# Altium project LCR.PrjPcb
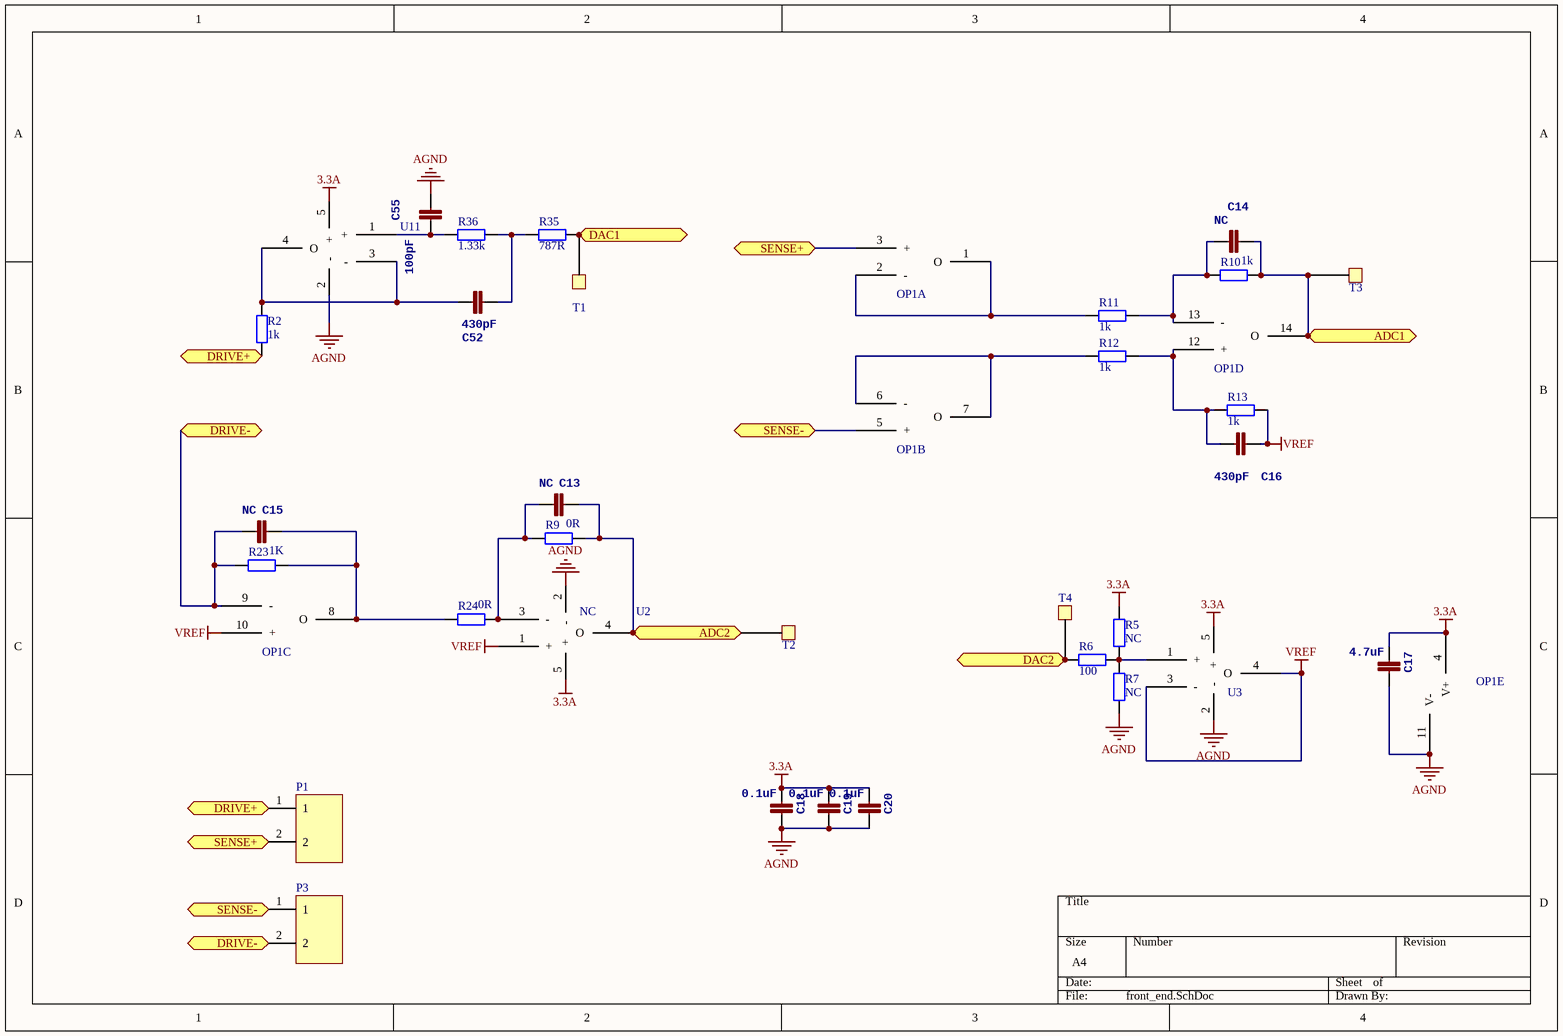
[diagram p0: front_end.SchDoc]
3 sheets, 74 parts. Net scope: flat (ports and power ports of the same name join across sheets).
Board file: LCR.PcbDoc
Sheets:
  front_end.SchDoc
  mcu.SchDoc
  power.SchDoc

## Sheet front_end.SchDoc
size A4

### Parts
C13  NC  [0402]
C14  NC  [0402]
C15  NC  [0402]
C16  430pF  [0402]
C17  4.7uF  [0603]
C18  0.1uF  [0402]
C19  0.1uF  [0402]
C20  0.1uF  [0402]
C52  430pF  [0402]
C55  100pF  [0402]
OP1  MCP6024  [TSSOP14_44MM_065P]  (value not drawn)  (parts A,B,C,D,E of 5)
P1  (no value)  [5.08-2P]
P3  (no value)  [5.08-2P]
R2  1k  [0603]
R5  NC  [0402]
R6  100  [0402]
R7  NC  [0402]
R9  0R  [0402]
R10  1k  [0402]
R11  1k  [0402]
R12  1k  [0402]
R13  1k  [0402]
R23  1K  [0603]
R24  0R  [0402]
R35  787R  [0402]
R36  1.33k  [0402]
T1  (no value)  [TestPad]
T2  (no value)  [TestPad]
T3  (no value)  [TestPad]
T4  (no value)  [TestPad]
U2  NC  [SOT23-5]
U3  OP-SOT23  [SOT23-5]  (value not drawn)
U11  OP-SOT23  [SOT23-5]  (value not drawn)

### Ports
ADC1, ADC2, DAC1, DAC2, DRIVE+, DRIVE-, SENSE+, SENSE-

### Nets
3.3A: C17.2 C18.2 C19.2 C20.2 OP1.4(V+) R5.2 U2.5(+) U3.5(+) U11.5(+)
AGND: C17.1 C18.1 C19.1 C20.1 C55.1 OP1.11(V-) R7.2 U2.2(-) U3.2(-) U11.2(-)
VREF: C16.1 OP1.10(+) R13.1 U2.1(+) U3.3(-) U3.4(O)
NetC13_1: C13.1 R9.1 T2.1 U2.4(O) ; port ADC2
NetC13_2: C13.2 R9.2 R24.1 U2.3(-)
NetC14_1: C14.1 OP1.14(O) R10.1 T3.1 ; port ADC1
NetC14_2: C14.2 OP1.13(-) R10.2 R11.1
NetC15_1: C15.1 OP1.8(O) R23.1 R24.2
NetC15_2: C15.2 OP1.9(-) P3.2 R23.2 ; port DRIVE-
NetC16_2: C16.2 OP1.12(+) R12.1 R13.2
NetC52_1: C52.1 R2.1 U11.3(-) U11.4(O)
NetC52_2: C52.2 R35.1 R36.2
NetC55_2: C55.2 R36.1 U11.1(+)
NetMCU1_20: R35.2 T1.1 ; port DAC1
NetMCU1_21: R6.2 T4.1 ; port DAC2
NetOP1_1: OP1.1(O) OP1.2(-) R11.2
NetOP1_3: OP1.3(+) P1.2 ; port SENSE+
NetOP1_5: OP1.5(+) P3.1 ; port SENSE-
NetOP1_6: OP1.6(-) OP1.7(O) R12.2
NetP1_1: P1.1 R2.2 ; port DRIVE+
NetR5_1: R5.1 R6.1 R7.1 U3.1(+)

### Library data of the parts
C13-C20 C52 C55 = CAP0402-CAP: <b>Capacitor</b> / Standard 0603 ceramic capacitor, and 0.1" leaded capacitor.; PARTNO: CC0402ZRY5V7BB104
OP1 = OP-SOP14
P1 P3 = 2P
R2 R5-R7 R9-R13 R23 R24 = Res2: Resistor; Value: 0Ohm; Published: 8-Jun-2000; LatestRevisionDate: 17-Jul-2002; LatestRevisionNote: Re-released for DXP Platform.; PackageReference: AXIAL-0.4; Publisher: Altium Limited; PackageDescription: Axial Device, Thru-Hole; 2 Leads; 0.4 in Pin Spacing
R35 R36 = Res2: Resistor; Published: 8-Jun-2000; LatestRevisionDate: 17-Jul-2002; LatestRevisionNote: Re-released for DXP Platform.; PackageReference: AXIAL-0.4; Publisher: Altium Limited; PackageDescription: Axial Device, Thru-Hole; 2 Leads; 0.4 in Pin Spacing
T1-T4 = TestPad
U2 = OP-SOT23

## Sheet mcu.SchDoc
size A4
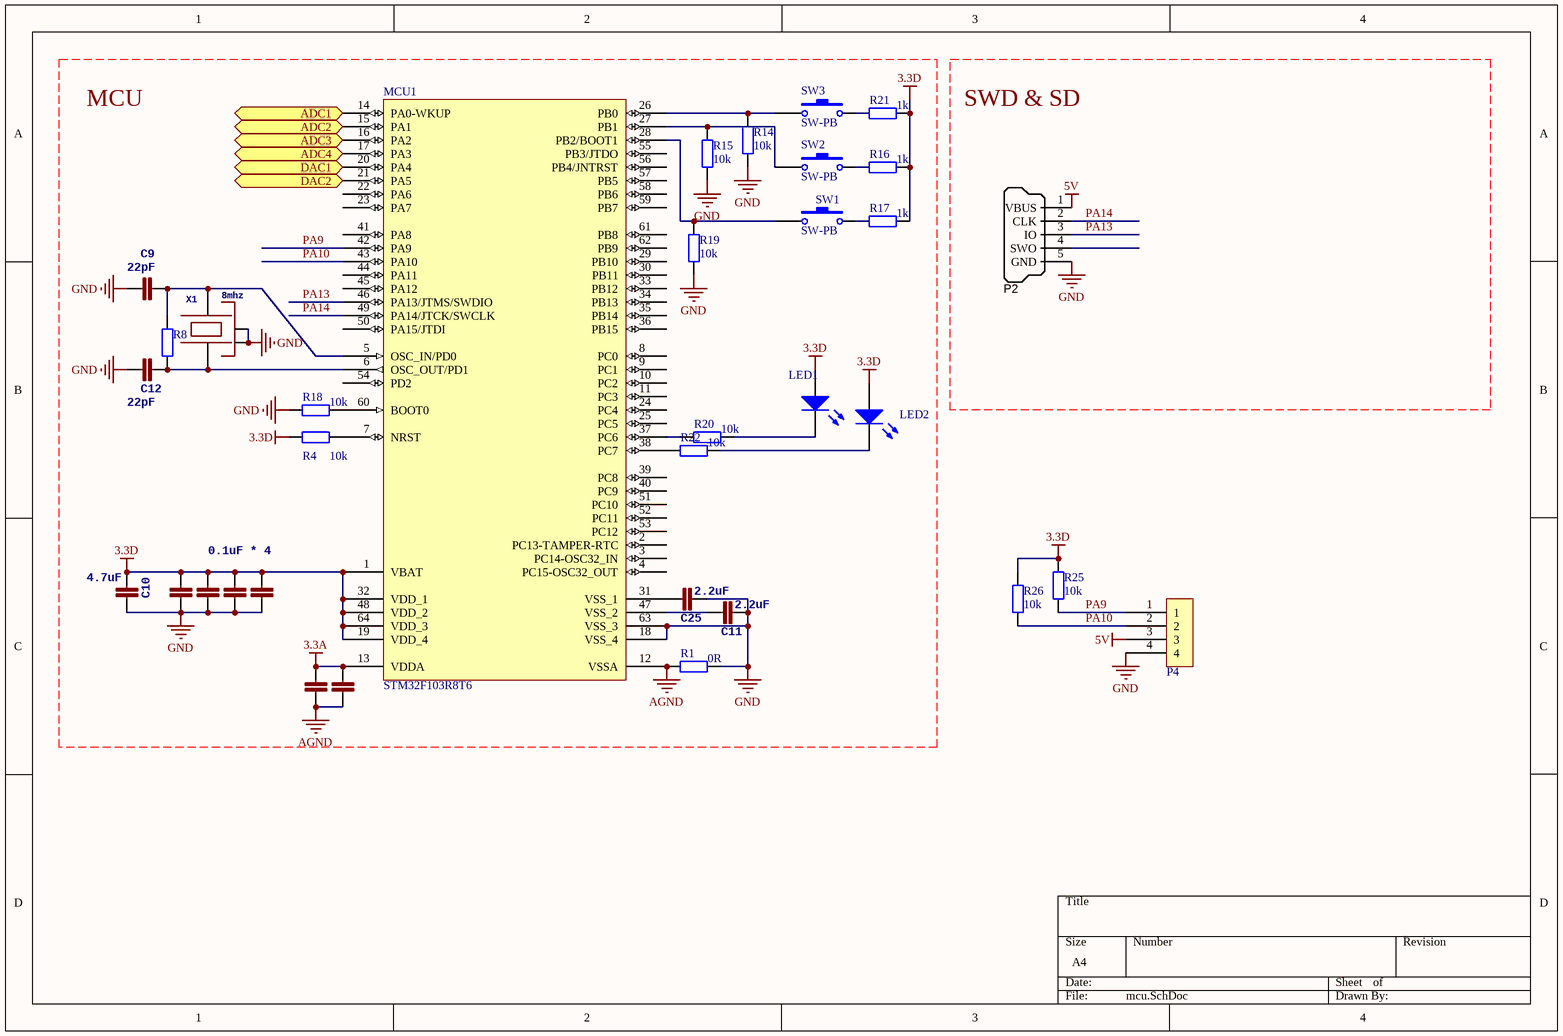
[diagram p1: mcu.SchDoc]

### Parts
C3  1n  [0402]  (value not drawn)
C4  0.1uF * 4  [0402]
C5  1n  [0402]  (value not drawn)
C6  1n  [0402]  (value not drawn)
C7  1n  [0402]  (value not drawn)
C8  1n  [0402]  (value not drawn)
C9  22pF  [0402]
C10  4.7uF  [0603]
C11  2.2uF  [0603]
C12  22pF  [0402]
C25  2.2uF  [0603]
LED1  LED0  [0603]  (value not drawn)
LED2  LED0  [0603]  (value not drawn)
MCU1  STM32F103R8T6  [LQFP64_N]
P2  SWD_MicroUSB  [MICRO-YZX]  (value not drawn)
P4  UART/I2C  [4pSocket]  (value not drawn)
R1  0R  [0402]
R4  10k  [0402]
R8  (no value)  [0402]
R14  10k  [0402]
R15  10k  [0402]
R16  1k  [0402]
R17  1k  [0402]
R18  10k  [0402]
R19  10k  [0402]
R20  10k  [0402]
R21  1k  [0402]
R22  10k  [0402]
R25  10k  [0402]
R26  10k  [0402]
SW1  SW-PB  [SW3x4]
SW2  SW-PB  [SW3x4]
SW3  SW-PB  [SW3x4]
X1  8mhz  [OSCILLATOR-3.2X2.5]

### Ports
ADC1, ADC2, ADC3, ADC4, DAC1, DAC2

### Nets
3.3A: C3.1 C8.1 MCU1.13(VDDA)
3.3D: C4.2 C5.2 C6.2 C7.2 C10.2 LED1.1(A) LED2.1(A) MCU1.1(VBAT) MCU1.19(VDD_4) MCU1.32(VDD_1) MCU1.48(VDD_2) MCU1.64(VDD_3) R4.2 R16.2 R17.2 R21.2 R25.2 R26.2
5V: P2.1(VBUS) P4.3
AGND: C3.2 C8.2 MCU1.12(VSSA) R1.1
GND: C4.1 C5.1 C6.1 C7.1 C9.2 C10.1 C11.2 C12.2 C25.2 MCU1.18(VSS_4) MCU1.63(VSS_3) P2.5(GND) P4.4 R1.2 R14.1 R15.1 R18.1 R19.1 X1.2(NC_2) X1.4(NC_4)
PA9: MCU1.42(PA9) P4.1 R25.1
PA10: MCU1.43(PA10) P4.2 R26.1
PA13: MCU1.46(PA13/JTMS/SWDIO) P2.3(IO)
PA14: MCU1.49(PA14/JTCK/SWCLK) P2.2(CLK)
NetC9_1: C9.1 MCU1.5(OSC_IN/PD0) R8.2 X1.3
NetC11_1: C11.1 MCU1.47(VSS_2)
NetC12_1: C12.1 MCU1.6(OSC_OUT/PD1) R8.1 X1.1
NetC13_1: MCU1.15(PA1) ; port ADC2
NetC14_1: MCU1.14(PA0-WKUP) ; port ADC1
NetC25_1: C25.1 MCU1.31(VSS_1)
NetLED1_2: LED1.2(K) R20.2
NetLED2_2: LED2.2(K) R22.2
NetMCU1_7: MCU1.7(NRST) R4.1
NetMCU1_16: MCU1.16(PA2) ; port ADC3
NetMCU1_17: MCU1.17(PA3) ; port ADC4
NetMCU1_20: MCU1.20(PA4) ; port DAC1
NetMCU1_21: MCU1.21(PA5) ; port DAC2
NetMCU1_26: MCU1.26(PB0) R14.2 SW3.1
NetMCU1_27: MCU1.27(PB1) R15.2 SW2.1
NetMCU1_28: MCU1.28(PB2/BOOT1) R19.2 SW1.1
NetMCU1_37: MCU1.37(PC6) R20.1
NetMCU1_38: MCU1.38(PC7) R22.1
NetMCU1_60: MCU1.60(BOOT0) R18.2
NetR16_1: R16.1 SW2.2
NetR17_1: R17.1 SW1.2
NetR21_1: R21.1 SW3.2

Not connected (* = marked no-connect by the designer): MCU1 2(PC13-TAMPER-RTC) 3(PC14-OSC32_IN) 4(PC15-OSC32_OUT) 8(PC0) 9(PC1) 10(PC2) 11(PC3) 22(PA6) 23(PA7) 24(PC4) 25(PC5) 29(PB10) 30(PB11) 33(PB12) 34(PB13) 35(PB14) 36(PB15) 39(PC8) 40(PC9) 41(PA8) 44(PA11) 45(PA12) 50(PA15/JTDI) 51(PC10) 52(PC11) 53(PC12) 54(PD2) 55(PB3/JTDO) 56(PB4/JNTRST) 57(PB5) 58(PB6) 59(PB7) 61(PB8) 62(PB9); P2 4(SWO)

### Notes on the sheet
- MCU
- SWD & SD

### Library data of the parts
C3-C12 C25 = CAP0402-CAP: as C13 on sheet front_end
LED1 LED2 = LED0: Typical INFRARED GaAs LED; Published: 8-Jun-2000; LatestRevisionDate: 08-Jul-2005; LatestRevisionNote: Mech Layer 1 removed.; PackageReference: LED-0; Publisher: Altium Limited; PackageDescription: LED; 2 Leads
MCU1 = STM32F103R8T6: STM32 ARM-based 32-bit MCU with 64 Kbytes Flash, 64-pin LQFP, Industrial Temperature; Published: *; DatasheetVersion: *; PackageVersion: *; PackageReference: *; Publisher: *; PackageDescription: *; ComponentLink1Description: *; ComponentLink1URL: *; ComponentLink2Description: *; ComponentLink2URL: *
P2 = SWD_MicroUSB: Connector SMD USB Micro Type B middle mount; Manufacturer 1: Molex Inc; SCDType: undef; Package / Case: SMD; Supplier 1: Digi-Key; Supplier Part Number 1: WM17142CT-ND
P4 = 4PSocket
R1 R4 R8 R14-R22 R25 R26 = Res2: Resistor; Value: 0Ohm; Published: 8-Jun-2000; LatestRevisionDate: 17-Jul-2002; LatestRevisionNote: Re-released for DXP Platform.; PackageReference: AXIAL-0.4; Publisher: Altium Limited; PackageDescription: Axial Device, Thru-Hole; 2 Leads; 0.4 in Pin Spacing
SW1-SW3 = SW-PB: Switch; Published: 24-Mar-1999; LatestRevisionDate: 17-Jul-2002; LatestRevisionNote: Re-released for DXP Platform.; PackageReference: SPST-2; Publisher: Altium Limited; PackageDescription: Switch; 2 Leads
X1 = OSCILLATOR-3.2X2.5: Crystal Oscillator in 3.2x2.5 SMD

## Sheet power.SchDoc
size A4
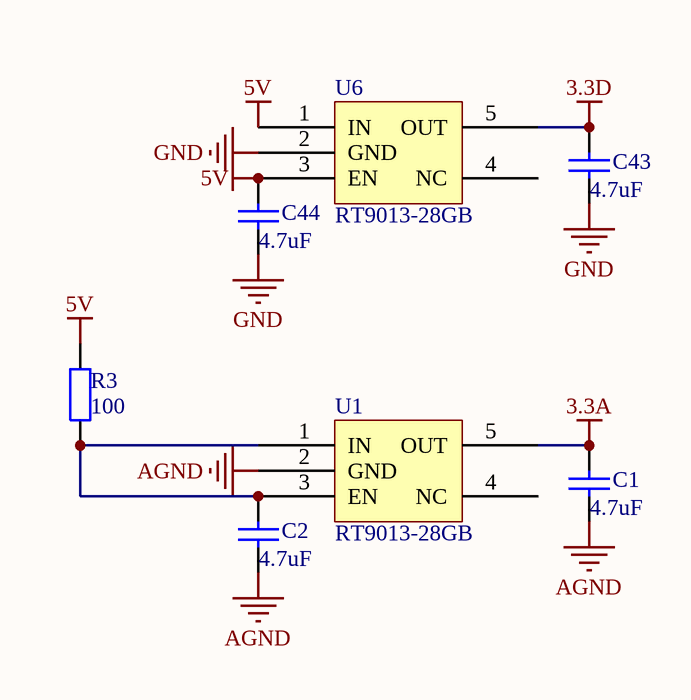
[diagram p2: power.SchDoc]

### Parts
C1  4.7uF  [0603]
C2  4.7uF  [0603]
C43  4.7uF  [0603]
C44  4.7uF  [0603]
R3  100  [0603]
U1  RT9013-28GB  [SOT23-5]
U6  RT9013-28GB  [SOT23-5]

### Nets
3.3A: C1.2 U1.5(OUT)
3.3D: C43.2 U6.5(OUT)
5V: C44.2 R3.2 U6.1(IN) U6.3(EN)
AGND: C1.1 C2.1 U1.2(GND)
GND: C43.1 C44.1 U6.2(GND)
NetC2_2: C2.2 R3.1 U1.1(IN) U1.3(EN)

Not connected (* = marked no-connect by the designer): U1 4(NC); U6 4(NC)

### Library data of the parts
C1 C2 C43 C44 = Cap: Capacitor; Published: 8-Jun-2000; LatestRevisionDate: 17-Jul-2002; LatestRevisionNote: Re-released for DXP Platform.; PackageReference: RAD-0.3; Publisher: Altium Limited; PackageDescription: Radial Cap, Thru-Hole; 2 Leads; 0.3 in Pin Spacing
R3 = Res2: Resistor; Value: 0Ohm; Published: 8-Jun-2000; LatestRevisionDate: 17-Jul-2002; LatestRevisionNote: Re-released for DXP Platform.; PackageReference: AXIAL-0.4; Publisher: Altium Limited; PackageDescription: Axial Device, Thru-Hole; 2 Leads; 0.4 in Pin Spacing
U1 U6 = LP5907

## Nets that join several sheets
3.3A: front_end (9 pins), mcu (C3.1 C8.1 MCU1.13), power (C1.2 U1.5)
3.3D: mcu (18 pins), power (C43.2 U6.5)
5V: mcu (P2.1 P4.3), power (C44.2 R3.2 U6.1 U6.3)
AGND: front_end (10 pins), mcu (C3.2 C8.2 MCU1.12 R1.1), power (C1.1 C2.1 U1.2)
GND: mcu (20 pins), power (C43.1 C44.1 U6.2)
NetC13_1: front_end (C13.1 R9.1 T2.1 U2.4), mcu (MCU1.15)
NetC14_1: front_end (C14.1 OP1.14 R10.1 T3.1), mcu (MCU1.14)
NetMCU1_20: front_end (R35.2 T1.1), mcu (MCU1.20)
NetMCU1_21: front_end (R6.2 T4.1), mcu (MCU1.21)